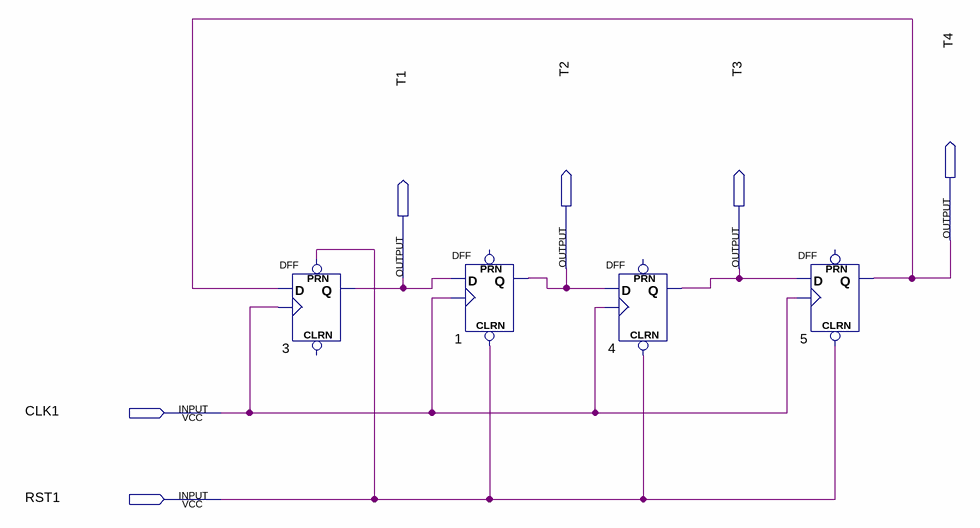
[diagram p0: schematic sheet]
// Quartus schematic prj03.bdf as structural Verilog: 4 symbols, 6 pins
module prj03 (
  input  CLK1,
  input  RST1,
  output T4,
  output T2,
  output T3,
  output T1
);

  DFF u_3 (.CLK(CLK1), .D(T4), .PRN(RST1), .Q(T1));  // open: CLRN
  DFF u_1 (.CLRN(RST1), .CLK(CLK1), .D(T1), .Q(T2));  // open: PRN
  DFF u_4 (.CLRN(RST1), .CLK(CLK1), .D(T2), .Q(T3));  // open: PRN
  DFF u_5 (.CLRN(RST1), .CLK(CLK1), .D(T3), .Q(T4));  // open: PRN
endmodule
